# EAGLE design bravo-v3 (EAGLE 9.1.3)

## Sheet 1 of 2
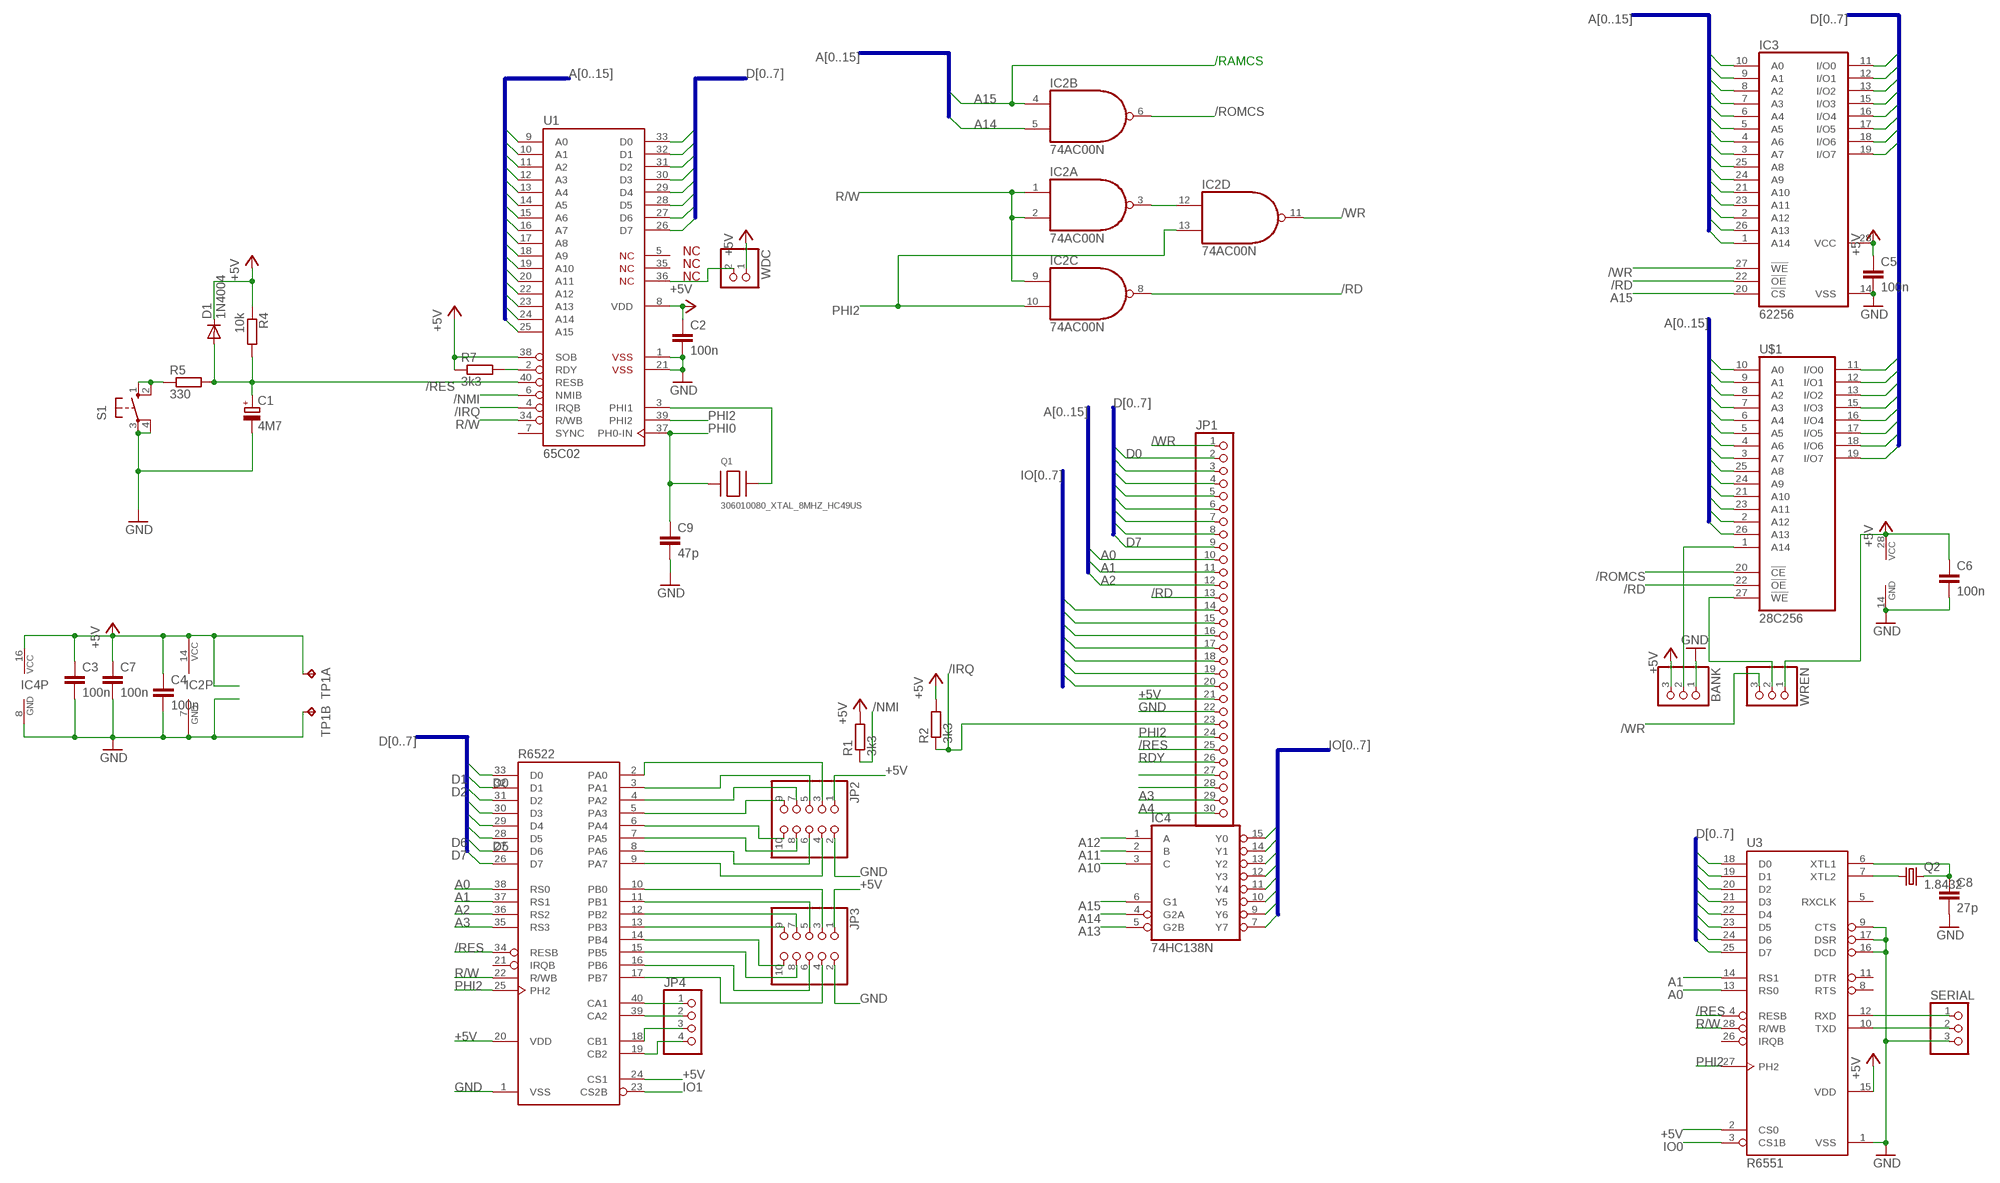
[diagram p0: schematic, sheet 1]

### Parts
BANK  PINHD-1X3  [1X03]
C1  4M7  CPOL-EUE2.5-6  [E2,5-6]
C2  100n  C-EU025-030X050  [C025-030X050]
C3  100n  C-EU025-030X050  [C025-030X050]
C4  100n  C-EU025-030X050  [C025-030X050]
C5  100n  C-EU025-030X050  [C025-030X050]
C6  100n  C-EU025-030X050  [C025-030X050]
C7  100n  C-EU025-030X050  [C025-030X050]
C8  27p  C-EU050-030X075  [C050-030X075]
C9  47p  C-EU025-030X050  [C025-030X050]
D1  1N4004  [DO41-10]
IC2  74AC00N  74ALS00N  [DIL14]
IC3  62256  62256P  [DIL28-6]
IC4  74HC138N  [DIL16]
JP1  PINHD-1X30  [1X30]
JP2  PINHD-2X5  [2X05]
JP3  PINHD-2X5  [2X05]
JP4  PINHD-1X4  [1X04]
Q1  306010080_XTAL_8MHZ_HC49US  [HC49US]
Q2  1.8432  CRYSTALHC49S  [HC49/S]
R1  3k3  R-EU_0207/7  [0207/7]
R2  3k3  R-EU_0207/7  [0207/7]
R4  10k  R-EU_0207/7  [0207/7]
R5  330  R-EU_0207/7  [0207/7]
R7  3k3  R-EU_0207/7  [0207/7]
R6522  G65SC22P  [DIP-40]
S1  40-XX  [B3F-40XX]
SERIAL  PINHD-1X3  [1X03]
TP1  TP2P2-38-17  [P2-38-17]
U1  65C02  G65SC02P  [DIP-40]
U3  R6551  G65SC51P  [DIP-28]
U$1  28C256  [DIL28]
WDC  PINHD-1X2  [1X02]
WREN  PINHD-1X3  [1X03]

### Nets
+5V [supply]: BANK.3 C2.1 C3.1 C4.1 C5.1 C6.1 C7.1 D1.C IC2.14(P:VCC) IC3.28(VCC) IC4.16(VCC) JP1.21 JP2.1 JP3.1 R1.2 R2.2 R4.1 R7.1 R6522.20(VDD) R6522.24(CS1) TP1.TP-1 U1.8(VDD) U1.38(SOB) U3.2(CS0) U3.15(VDD) U$1.28(VCC) WDC.1 WREN.1
/IRQ: JP1.23 R2.1 U1.4(IRQB)
/NMI: R1.1 U1.6(NMIB)
/RD: IC2.8(C:O) IC3.22(!OE) JP1.13 U$1.22(!OE)
/RES: C1.+ D1.A JP1.25 R4.2 R5.2 R6522.34(RESB) U1.40(RESB) U3.4(RESB)
/ROMCS: IC2.6(B:O) U$1.20(!CE)
/WR: IC2.11(D:O) IC3.27(!WE) JP1.1 WREN.3
A0: IC3.10(A0) JP1.10 R6522.38(RS0) U1.9(A0) U3.13(RS0) U$1.10(A0)
A1: IC3.9(A1) JP1.11 R6522.37(RS1) U1.10(A1) U3.14(RS1) U$1.9(A1)
A2: IC3.8(A2) JP1.12 R6522.36(RS2) U1.11(A2) U$1.8(A2)
A3: IC3.7(A3) JP1.29 R6522.35(RS3) U1.12(A3) U$1.7(A3)
A4: IC3.6(A4) JP1.30 U1.13(A4) U$1.6(A4)
A5: IC3.5(A5) U1.14(A5) U$1.5(A5)
A6: IC3.4(A6) U1.15(A6) U$1.4(A6)
A7: IC3.3(A7) U1.16(A7) U$1.3(A7)
A8: IC3.25(A8) U1.17(A8) U$1.25(A8)
A9: IC3.24(A9) U1.18(A9) U$1.24(A9)
A10: IC3.21(A10) IC4.3(C) U1.19(A10) U$1.21(A10)
A11: IC3.23(A11) IC4.2(B) U1.20(A11) U$1.23(A11)
A12: IC3.2(A12) IC4.1(A) U1.22(A12) U$1.2(A12)
A13: IC3.26(A13) IC4.5(G2B) U1.23(A13) U$1.26(A13)
A14: IC2.5(B:I1) IC3.1(A14) IC4.4(G2A) U1.24(A14)
A15: IC2.4(B:I0) IC3.20(!CS) IC4.6(G1) U1.25(A15)
CA1: JP4.1 R6522.40(CA1)
D0: IC3.11(I/O0) JP1.2 R6522.33(D0) U1.33(D0) U3.18(D0) U$1.11(I/O0)
D1: IC3.12(I/O1) JP1.3 R6522.32(D1) U1.32(D1) U3.19(D1) U$1.12(I/O1)
D2: IC3.13(I/O2) JP1.4 R6522.31(D2) U1.31(D2) U3.20(D2) U$1.13(I/O2)
D3: IC3.15(I/O3) JP1.5 R6522.30(D3) U1.30(D3) U3.21(D3) U$1.15(I/O3)
D4: IC3.16(I/O4) JP1.6 R6522.29(D4) U1.29(D4) U3.22(D4) U$1.16(I/O4)
D5: IC3.17(I/O5) JP1.7 R6522.28(D5) U1.28(D5) U3.23(D5) U$1.17(I/O5)
D6: IC3.18(I/O6) JP1.8 R6522.27(D6) U1.27(D6) U3.24(D6) U$1.18(I/O6)
D7: IC3.19(I/O7) JP1.9 R6522.26(D7) U1.26(D7) U3.25(D7) U$1.19(I/O7)
GND [supply]: BANK.1 C1.- C2.2 C3.2 C4.2 C5.2 C6.2 C7.2 C8.2 C9.2 IC2.7(P:GND) IC3.14(VSS) IC4.8(GND) JP1.22 JP2.2 JP3.2 R6522.1(VSS) S1.3(P) S1.4(P1) SERIAL.3 TP1.TP-2 U1.1(VSS$1) U1.21(VSS$2) U3.1(VSS) U3.9(CTS) U3.16(DCD) U3.17(DSR) U$1.14(GND)
IO0: IC4.15(Y0) U3.3(CS1B)
IO1: IC4.14(Y1) JP1.14 R6522.23(CS2B)
IO2: IC4.13(Y2) JP1.15
IO3: IC4.12(Y3) JP1.16
IO4: IC4.11(Y4) JP1.17
IO5: IC4.10(Y5) JP1.18
IO6: IC4.9(Y6) JP1.19
IO7: IC4.7(Y7) JP1.20
N$1: R5.1 S1.1(S) S1.2(S1)
N$2: JP2.9 R6522.5(PA3)
N$3: JP2.7 R6522.4(PA2)
N$4: JP1.27
N$5: JP1.28
N$6: JP2.5 R6522.3(PA1)
N$7: JP2.3 R6522.2(PA0)
N$8: U1.36(NC$3) WDC.2
N$9: BANK.2 U$1.1(A14)
N$10: IC2.3(A:O) IC2.12(D:I0)
N$11: JP2.10 R6522.6(PA4)
N$12: JP2.8 R6522.7(PA5)
N$13: JP2.6 R6522.8(PA6)
N$14: JP2.4 R6522.9(PA7)
N$15: JP3.3 R6522.10(PB0)
N$16: JP3.5 R6522.11(PB1)
N$17: JP3.7 R6522.12(PB2)
N$18: JP3.9 R6522.13(PB3)
N$19: JP3.10 R6522.14(PB4)
N$20: JP3.8 R6522.15(PB5)
N$21: JP3.6 R6522.16(PB6)
N$22: JP3.4 R6522.17(PB7)
N$24: JP4.2 R6522.39(CA2)
N$25: JP4.3 R6522.18(CB1)
N$26: JP4.4 R6522.19(CB2)
N$31: U$1.27(!WE) WREN.2
N$33: Q1.P$2 U1.3(PHI1)
N$35: SERIAL.1 U3.12(RXD)
N$36: SERIAL.2 U3.10(TXD)
N$38: Q2.1 U3.7(XTL2)
N$39: C8.1 Q2.2 U3.6(XTL1)
PHI0: C9.1 Q1.P$1 U1.37(PH0-IN)
PHI2: IC2.10(C:I1) IC2.13(D:I1) JP1.24 R6522.25(PH2) U1.39(PHI2) U3.27(PH2)
R/W: IC2.1(A:I0) IC2.2(A:I1) IC2.9(C:I0) R6522.22(R/WB) U1.34(R/WB) U3.28(R/WB)
RDY: JP1.26 R7.2 U1.2(RDY)
Unconnected: R6522.21(IRQB) U1.5(NC$1) U1.7(SYNC) U1.35(NC$2) U3.5(RXCLK) U3.8(RTS) U3.11(DTR) U3.26(IRQB)

### Buses
A[0..15]
D[0..7]
IO[0..7]

### Notes on the sheet
- /RAMCS

## Sheet 2 of 2

## Library data of the parts
BANK SERIAL WREN = pinhead:PINHD-1X3: PIN HEADER
C1 = rcl:CPOL-EU: POLARIZED CAPACITOR, European symbol
C2-C9 = rcl:C-EU: CAPACITOR, European symbol
D1 = adafruit:1N4004: DIODE General purpose 1N400x type rectifier (With bigger pads) http://www.ladyada.net/library/pcb/eaglelibrary.html
IC2 = 74xx-us:74*00: Quad 2-input NAND gate
IC3 = memory-hitachi:62256P: MEMORY; OC_FARNELL: unknown; OC_NEWARK: unknown
IC4 = 74xx-eu:74*138: 3-line to 8-line DECODER/DEMULTIPLEXER
JP1 = pinhead:PINHD-1X30: PIN HEADER
JP2 JP3 = pinhead:PINHD-2X5: PIN HEADER
JP4 = pinhead:PINHD-1X4: PIN HEADER
Q1 = Seeed-OPL-2017-01-Crystal-Akita:306010080_XTAL_8MHZ_HC49US: HC49/US-11.35X4.65X3.6, DIP Crystal 8MHz-20pF-30ppm-80R, SKU: 306010080
Q2 = adafruit:CRYSTAL: CRYSTAL; OC_FARNELL: 1667008; OC_NEWARK: unknown
R1 R2 R4 R5 R7 = rcl:R-EU_: RESISTOR, European symbol
R6522 = 65xxx:G65SC22P: California Micro Devices Version
S1 = adafruit:40-XX: OMRON SWITCH; MF: OMRON COMPONENTS USA; MPN: B3F-4000; OC_FARNELL: 176434; OC_NEWARK: 36K3105
TP1 = testpad:TP2: Test pad
U1 = 65xxx:G65SC02P: California Micro Devices Version
U3 = 65xxx:G65SC51P: California Micro Devices Version
U$1 = memory:28C256: MEMORY
WDC = pinhead:PINHD-1X2: PIN HEADER

## Net classes
1 supply: width 0.61 mm

## Board
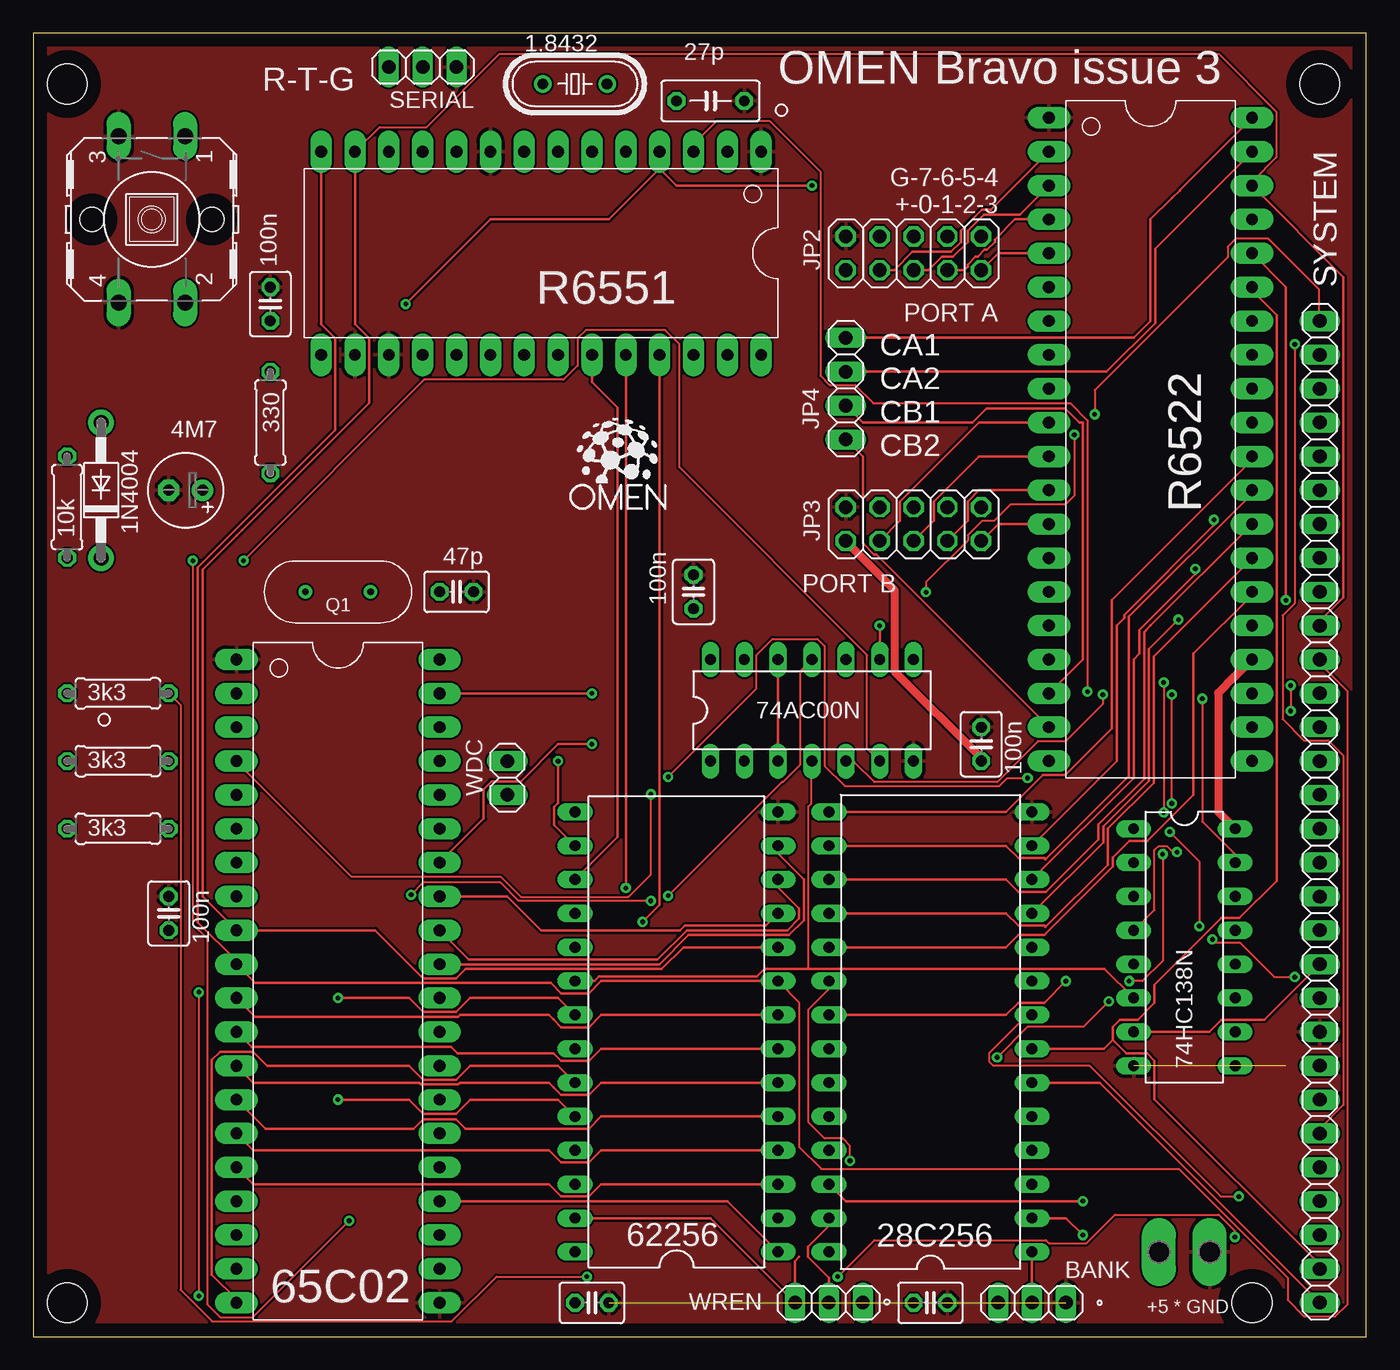
[diagram p1: board, top side]
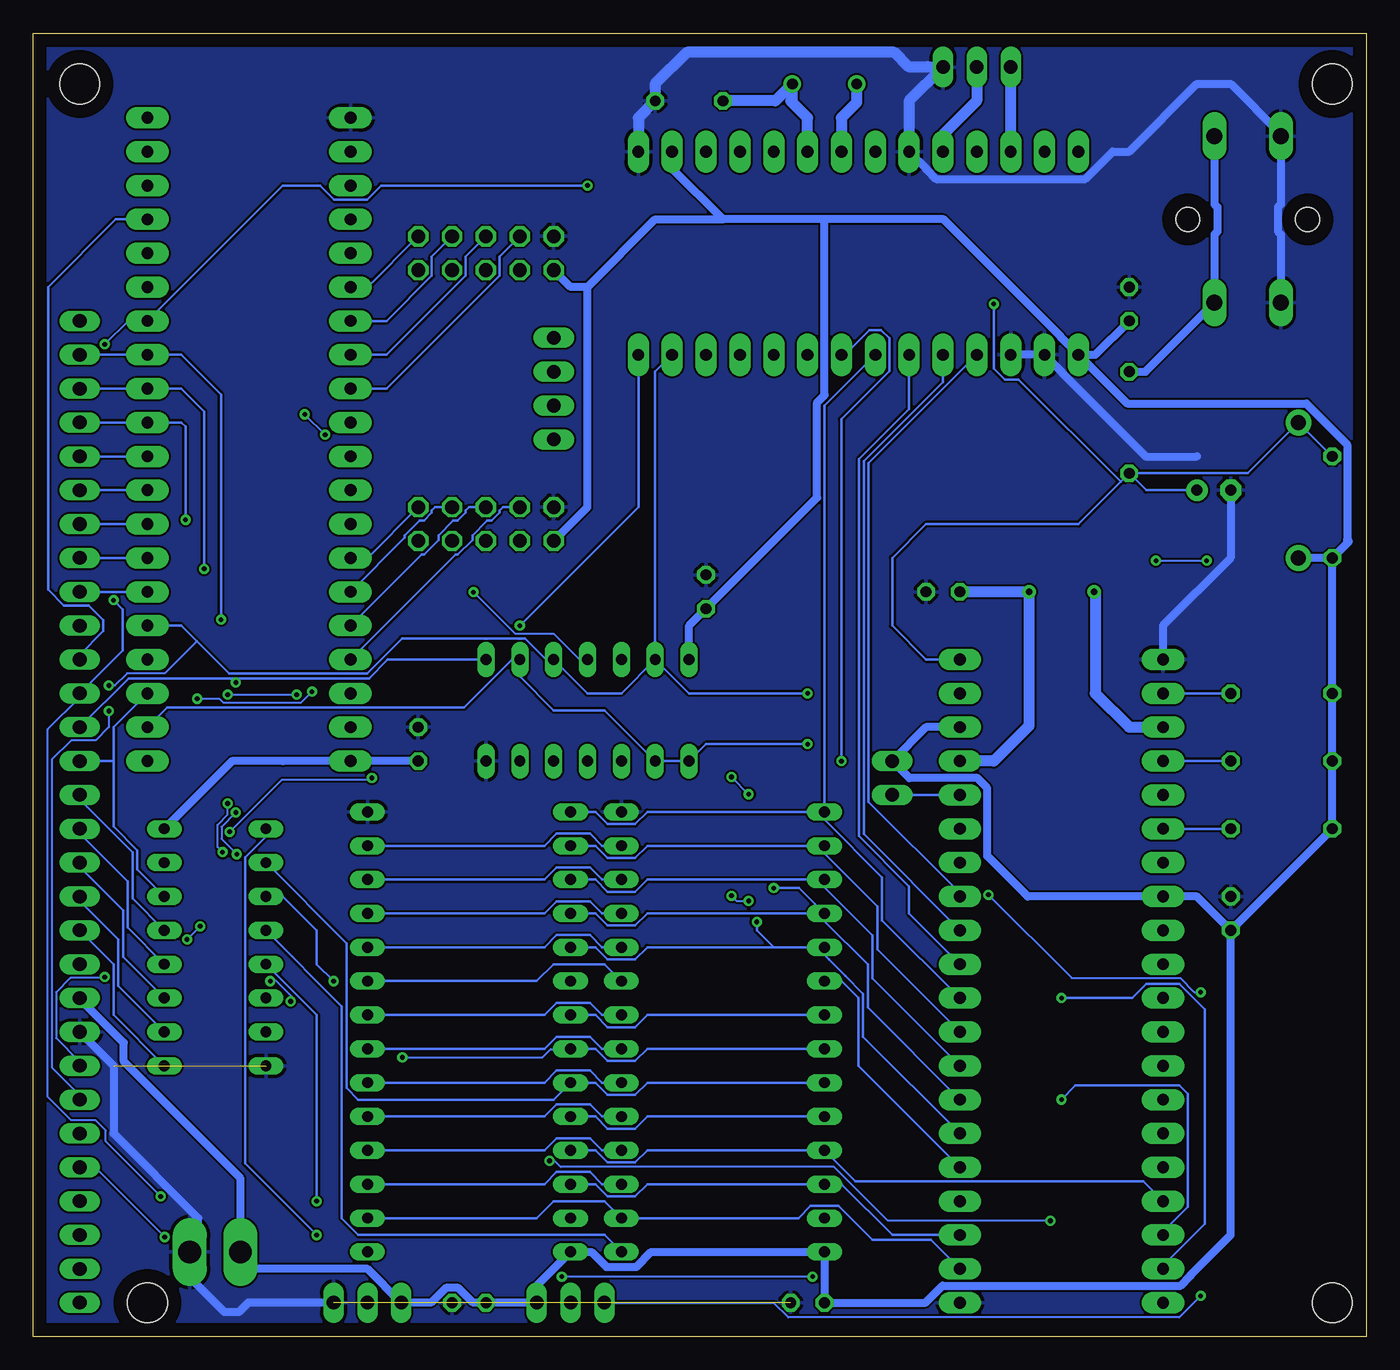
[diagram p2: board, bottom side, seen from below]

Size 100 x 97.78 mm. Coordinates in mm from the lower left corner, seen from the top.
Outline: 0,0 100,0 100,97.78 0,97.78 0,0
Copper layers (1*16): Top 0.035mm / dielectric 1.5mm / Bottom 0.035mm
Design rules "default": minimum track width 6mil, minimum drill 0.35mm, track to track 6mil, track to pad 6mil, pad to pad 6mil, via to via 6mil, smd to smd 6mil, copper to edge 40mil, drill to drill 6mil, minimum pad ring 10mil, minimum via ring 8mil, stop-mask expansion 4mil, vias tented up to drill 0mil, thermal gap 10mil
Holes 3 mm at 2.54,2.54 2.54,93.98 91.44,2.54 96.52,93.98

### Footprints (pad centres in the part's own frame; a part is rotated, then mirrored left to right if it is on the bottom)
1X03 = drill 1.016 long: 1 -2.54,0; 2 0,0; 3 2.54,0
E2,5-6 = drill 0.813 pad 1.6: + -1.27,0 | drill 0.813 pad 1.6 octagon: - 1.27,0
C025-030X050 = drill 0.813 octagon: 1 -1.27,0; 2 1.27,0
C050-030X075 = drill 0.813 octagon: 1 -2.54,0; 2 2.54,0
DO41-10 = drill 1.118 pad 1.93: A 5.08,0; C -5.08,0
DIL14 = drill 0.813 long: 1 -7.62,-3.81; 2 -5.08,-3.81; 3 -2.54,-3.81; 4 0,-3.81; 5 2.54,-3.81; 6 5.08,-3.81; 7 7.62,-3.81; 8 7.62,3.81; 9 5.08,3.81; 10 2.54,3.81; 11 0,3.81; 12 -2.54,3.81; 13 -5.08,3.81; 14 -7.62,3.81
DIL28-6 = drill 0.813 long: 1 -16.51,-7.62; 2 -13.97,-7.62; 3 -11.43,-7.62; 4 -8.89,-7.62; 5 -6.35,-7.62; 6 -3.81,-7.62; 7 -1.27,-7.62; 8 1.27,-7.62; 9 3.81,-7.62; 10 6.35,-7.62; 11 8.89,-7.62; 12 11.43,-7.62; 13 13.97,-7.62; 14 16.51,-7.62; 15 16.51,7.62; 16 13.97,7.62; 17 11.43,7.62; 18 8.89,7.62; 19 6.35,7.62; 20 3.81,7.62; 21 1.27,7.62; 22 -1.27,7.62; 23 -3.81,7.62; 24 -6.35,7.62; 25 -8.89,7.62; 26 -11.43,7.62; 27 -13.97,7.62; 28 -16.51,7.62
DIL16 = drill 0.813 long: 1 -8.89,-3.81; 2 -6.35,-3.81; 3 -3.81,-3.81; 4 -1.27,-3.81; 5 1.27,-3.81; 6 3.81,-3.81; 7 6.35,-3.81; 8 8.89,-3.81; 9 8.89,3.81; 10 6.35,3.81; 11 3.81,3.81; 12 1.27,3.81; 13 -1.27,3.81; 14 -3.81,3.81; 15 -6.35,3.81; 16 -8.89,3.81
1X30 = drill 1.016 long: 1 -36.83,0; 2 -34.29,0; 3 -31.75,0; 4 -29.21,0; 5 -26.67,0; 6 -24.13,0; 7 -21.59,0; 8 -19.05,0; 9 -16.51,0; 10 -13.97,0; 11 -11.43,0; 12 -8.89,0; 13 -6.35,0; 14 -3.81,0; 15 -1.27,0; 16 1.27,0; 17 3.81,0; 18 6.35,0; 19 8.89,0; 20 11.43,0; 21 13.97,0; 22 16.51,0; 23 19.05,0; 24 21.59,0; 25 24.13,0; 26 26.67,0; 27 29.21,0; 28 31.75,0; 29 34.29,0; 30 36.83,0
2X05 = drill 1.016 octagon: 1 -5.08,-1.27; 2 -5.08,1.27; 3 -2.54,-1.27; 4 -2.54,1.27; 5 0,-1.27; 6 0,1.27; 7 2.54,-1.27; 8 2.54,1.27; 9 5.08,-1.27; 10 5.08,1.27
1X04 = drill 1.016 long: 1 -3.81,0; 2 -1.27,0; 3 1.27,0; 4 3.81,0
HC49US = drill 0.5: P$1 -2.44,0; P$2 2.44,0
HC49/S = drill 0.813: 1 -2.413,0; 2 2.413,0
0207/7 = drill 0.813 octagon: 1 -3.81,0; 2 3.81,0
DIP-40 = drill 0.889 pad 1.6 long: 1 -22.86,-7.62; 2 -20.32,-7.62; 3 -17.78,-7.62; 4 -15.24,-7.62; 5 -12.7,-7.62; 6 -10.16,-7.62; 7 -7.62,-7.62; 8 -5.08,-7.62; 9 -2.54,-7.62; 10 0,-7.62; 11 2.54,-7.62; 12 5.08,-7.62; 13 7.62,-7.62; 14 10.16,-7.62; 15 12.7,-7.62; 16 15.24,-7.62; 17 17.78,-7.62; 18 20.32,-7.62; 19 22.86,-7.62; 20 25.4,-7.62; 21 25.4,7.62; 22 22.86,7.62; 23 20.32,7.62; 24 17.78,7.62; 25 15.24,7.62; 26 12.7,7.62; 27 10.16,7.62; 28 7.62,7.62; 29 5.08,7.62; 30 2.54,7.62; 31 0,7.62; 32 -2.54,7.62; 33 -5.08,7.62; 34 -7.62,7.62; 35 -10.16,7.62; 36 -12.7,7.62; 37 -15.24,7.62; 38 -17.78,7.62; 39 -20.32,7.62; 40 -22.86,7.62
B3F-40XX = drill 1.194 long: 1 -6.248,2.489; 2 6.248,2.489; 3 -6.248,-2.489; 4 6.248,-2.489 | hole 1.803: 0,-4.496; 0,4.496
P2-38-17 = drill 1.702 pad 2.121 long: TP-1 -1.905,0; TP-2 1.905,0
DIP-28 = drill 0.889 pad 1.6 long: 1 -15.24,-7.62; 2 -12.7,-7.62; 3 -10.16,-7.62; 4 -7.62,-7.62; 5 -5.08,-7.62; 6 -2.54,-7.62; 7 0,-7.62; 8 2.54,-7.62; 9 5.08,-7.62; 10 7.62,-7.62; 11 10.16,-7.62; 12 12.7,-7.62; 13 15.24,-7.62; 14 17.78,-7.62; 15 17.78,7.62; 16 15.24,7.62; 17 12.7,7.62; 18 10.16,7.62; 19 7.62,7.62; 20 5.08,7.62; 21 2.54,7.62; 22 0,7.62; 23 -2.54,7.62; 24 -5.08,7.62; 25 -7.62,7.62; 26 -10.16,7.62; 27 -12.7,7.62; 28 -15.24,7.62
DIL28 = drill 0.813 long: 1 -16.51,-7.62; 2 -13.97,-7.62; 3 -11.43,-7.62; 4 -8.89,-7.62; 5 -6.35,-7.62; 6 -3.81,-7.62; 7 -1.27,-7.62; 8 1.27,-7.62; 9 3.81,-7.62; 10 6.35,-7.62; 11 8.89,-7.62; 12 11.43,-7.62; 13 13.97,-7.62; 14 16.51,-7.62; 15 16.51,7.62; 16 13.97,7.62; 17 11.43,7.62; 18 8.89,7.62; 19 6.35,7.62; 20 3.81,7.62; 21 1.27,7.62; 22 -1.27,7.62; 23 -3.81,7.62; 24 -6.35,7.62; 25 -8.89,7.62; 26 -11.43,7.62; 27 -13.97,7.62; 28 -16.51,7.62
1X02 = drill 1.016 long: 1 -1.27,0; 2 1.27,0

### Placement (x,y rotation side)
BANK  74.93,2.54 180 top
C1  11.43,63.5 180 top
C2  49.53,55.88 90 top
C3  17.78,77.47 90 top
C4  10.16,31.75 90 top
C5  67.31,2.54 0 top
C6  41.91,2.54 0 top
C7  71.12,44.45 90 top
C8  50.8,92.71 0 top
C9  31.75,55.88 0 top
D1  5.08,63.5 90 top
IC2  58.42,46.99 0 top
IC3  48.26,22.86 90 top
IC4  86.36,29.21 270 top
JP1  96.52,39.37 270 top
JP2  66.04,81.28 0 top
JP3  66.04,60.96 0 top
JP4  60.96,71.12 270 top
Q1  22.86,55.88 180 top
Q2  40.64,93.98 0 top
R1  6.35,38.1 180 top
R2  6.35,43.18 180 top
R4  2.54,62.23 90 top
R5  17.78,68.58 270 top
R7  6.35,48.26 0 top
R6522  83.82,68.58 270 top
S1  8.89,83.82 270 top
SERIAL  29.21,95.25 0 top
TP1  86.36,6.35 0 top
U1  22.86,27.94 270 top
U3  39.37,81.28 180 top
U$1  67.31,22.86 90 top
WDC  35.56,41.91 270 top
WREN  59.69,2.54 180 top

### Tracks (layer width: path | path; a pad name or v marks a point on that pad's centre or on a via)
+5V
  Top 0.61: R6522.24 90.16,49.52 90.12,49.52 88.9,48.3 88.9,39.37 IC4.16 | C7.1 71.09,43.2 71.09,43.43 64.62,49.91 64.62,56.01 60.96,59.66 JP3.1
  Bottom 0.61: C7.1 R6522.20 81.28,43.18 85.09,43.18 IC4.16 | C4.1 10.16,7.62 13.18,4.6 13.18,4.56 13.92,3.82 31.77,3.82 33.06,2.54 C6.1 IC3.28 53.64,6.35 54.76,5.23 57,5.23 58.12,6.35 U$1.28 62.23,3.81 WREN.1 C5.1 67,2.54 68.12,3.66 69.04,3.66 70.16,2.54 BANK.3 74.93,5.08 83.82,5.08 84.45,5.71 TP1.TP-1 84.45,11.87 93.22,20.64 93.22,22.04 96.52,25.35 JP1.21 | C4.1 R1.2 R2.2 R7.1 R4.1 | R4.1 D1.C | U1.38 33.02,45.72 WDC.1 34.28,41.9 29.16,41.9 28.42,41.16 28.42,36.04 25.4,33.02 U1.8 12.7,33.02 C4.1 | U3.15 17.93,70 4.49,70 1.42,66.93 1.42,59.79 1.32,59.69 1.32,59.64 R4.1 | U3.15 22.87,74.94 22.87,74.98 31.71,83.82 40.64,83.82 | 40.64,83.82 48.26,83.82 | U3.2 52.07,87.63 48.26,83.82 | U3.15 20.32,73.66 C3.1 | IC2.14 50.8,53.34 C2.1 41.2,62.94 41.2,70.08 40.64,70.64 40.64,83.82 | JP3.1 58.42,62.23 58.42,78.74 | 58.42,78.74 59.69,78.74 JP2.1 | 58.42,78.74 53.34,83.82 48.26,83.82
/IRQ  (via drill 0.35)
  Top 0.152: v94.64,26.98 93.12,26.98 90.53,29.57 88.7,29.57 v88.47,29.79 | v87.48,30.79 87.48,35.66 v85.27,37.87 | v74.6,41.91 73.08,41.91 72.47,41.3 60.88,41.3 59.36,42.82 59.36,51.82 58.83,52.35 55.47,52.35 54.25,51.13 54.25,48.62 v47.62,41.99 | v46.33,40.69 46.33,34.67 44.65,32.99 36.58,32.99 35.05,34.52 23.85,34.52 15.24,43.13 U1.4
  Bottom 0.152: v94.64,26.98 94.72,26.9 97.23,26.9 98.3,25.83 98.3,22.4 96.55,20.65 96.55,20.34 JP1.23 | v87.48,30.79 v88.47,29.79 | v85.27,37.87 81.38,41.76 74.75,41.76 v74.6,41.91 | v46.33,40.69 v47.62,41.99
  Bottom 0.203: R2.1 U1.4
/NMI
  Bottom 0.203: R1.1 U1.6
/RD  (via drill 0.35)
  Top 0.152: v72.31,20.95 74.6,23.24 78.79,23.24 v80.7,25.15 | v82.22,26.67 83.21,26.67 84.73,28.19 v84.73,36.2 | v84.81,49.07 v84.81,39.32
  Bottom 0.152: v72.31,20.95 61.8,20.95 61.19,21.57 59.74,21.57 U$1.22 | v80.7,25.15 80.47,25.38 81.84,26.75 82.14,26.75 v82.22,26.67 | v84.73,36.2 85.88,37.34 85.88,38.25 v84.81,39.32 | v84.81,49.07 84.81,49.3 84.81,49.39
  Bottom 0.203: U$1.22 57.83,21.59 56.92,20.68 54.84,20.68 53.93,21.59 IC3.22 | IC2.8 73.41,50.8 74.82,49.39 84.81,49.39 92.85,49.39 JP1.13
/RES  (via drill 0.35)
  Top 0.152: v94.64,74.45 94.64,55.02 93.73,54.1 93.73,46.33 95.33,44.73 97.16,44.73 98.3,43.59 98.3,17.37 96.55,15.62 96.55,15.24 JP1.25
  Top 0.203: v27.94,77.47 34.29,83.82 43.18,83.82 46.99,87.63 | 46.99,87.63 U3.4 | v58.42,86.36 48.26,86.36 46.99,87.63
  Bottom 0.152: v94.64,74.45 92.89,76.2 91.52,76.2 R6522.34
  Bottom 0.203: R4.2 D1.A 8.89,64.77 R5.2 | C1.+ 16.51,63.5 R5.2 | R5.2 18.41,64.14 | 18.41,64.14 21.59,60.96 33.02,60.96 35.56,58.42 35.56,53.34 33.02,50.8 U1.40 | v27.94,77.47 27.94,72.64 27.11,71.81 26.09,71.81 18.41,64.14 | R6522.34 81.28,86.36 78.49,86.36 77.44,85.31 74.96,85.31 73.91,86.36 v58.42,86.36
/ROMCS  (via drill 0.35)
  Top 0.152: v61.27,13.18 61.27,14.33 60.73,14.86 59.36,14.86 58.14,16.08 58.14,24.54 59.66,26.06 59.66,26.67 U$1.20 | v23.7,8.69 16.46,1.45 14.02,1.45 13.03,2.44 13.03,29.87 11.96,30.94 v11.96,58.22 | v15.77,58.22 29.34,71.78 39.78,71.78 40.84,72.85 40.84,74.91 41.45,75.51 47.4,75.51 48.46,74.45 48.46,65.23 62.56,51.13 62.56,44.12 63.48,43.2 IC2.6
  Bottom 0.152: v61.27,13.18 60.88,13.18 60.43,12.72 39.93,12.72 35.89,8.69 v23.7,8.69 | v15.77,58.22 v11.96,58.22
/WR  (via drill 0.35)
  Top 0.152: v66.98,55.85 66.98,56.62 70.1,59.74 70.1,60.12 71.17,61.19 72.08,61.19 73.3,62.41 77.42,62.41 78.11,63.09 v78.11,67.67 | v79.63,69.19 79.63,71.02 89.61,81 89.61,81.76 90.22,82.37 92.66,82.37 96.47,78.56 96.47,76.2 JP1.1 | v12.42,25.83 v12.42,3.05 | v28.35,33.15 29.26,34.06 35.05,34.06 36.42,32.69 v46.33,32.69 | v47.62,33.07 56.16,41.6 56.24,41.6 57.53,42.9 57.53,49.91 58.37,50.75 IC2.11
  Top 0.203: IC3.27 50.8,8.89 WREN.3 57.15,5.67 57.45,5.97
  Bottom 0.152: v66.98,55.85 63.86,52.73 60.96,52.73 59.05,50.83 58.45,50.83 IC2.11 | v79.63,69.19 v78.11,67.67 | v12.42,3.05 14.02,1.45 43.36,1.45 44.42,2.52 57.15,2.52 WREN.3 | v12.42,25.83 12.88,25.83 13.95,26.9 22.1,26.9 v28.35,33.15 | v46.33,32.69 47.24,32.69 v47.62,33.07
A0
  Top 0.152: R6522.38 91.52,86.41 91.52,86.72 93.27,88.47 93.27,91.9 88.92,96.24 34.98,96.24 29.49,90.75 25.98,90.75 24.16,88.92 U3.13
  Top 0.203: IC3.10 48.76,29.21 47.14,27.58 32.41,27.58 31.72,26.89 29.24,26.89 25.65,30.48 U1.9 12.7,33.02 12.7,57.56 15.67,60.53 | U3.13 24.13,75.95 25.18,74.9 25.18,70.04 15.67,60.53 | 15.67,60.53 15.24,60.1 | JP1.10 96.52,53.68 98.3,55.46 98.3,79.5 R6522.38
  Bottom 0.203: IC3.10 57.33,29.21 58.24,30.12 60.73,30.12 61.64,29.21 U$1.10
A1
  Top 0.152: JP1.11 96.55,50.75 96.55,50.44 98.6,48.39 98.6,2.44 97.69,1.52 95.33,1.52 94.11,2.74 94.11,4.42 85.95,12.57 59.13,12.57 57.45,14.25 57.45,25.07 55.93,26.59 IC3.9
  Top 0.203: IC3.9 42.59,26.67 41.68,25.76 39.6,25.76 38.83,26.53 16.65,26.53 U1.10 15.24,28.19 12.34,31.09 12.34,57.7 22.64,68 22.64,74.9 21.59,75.95 U3.14
  Bottom 0.203: U$1.9 62.23,26.67 60.96,27.94 57.15,27.94 IC3.9 | JP1.11 96.52,51.14 94.74,52.92 94.74,53.76 95.84,54.86 97.7,54.86 98.88,56.04 98.88,78.74 93.8,83.82 R6522.37
A2  (via drill 0.35)
  Top 0.152: v90.45,10.52 89.08,10.52 79.25,20.34 72.01,20.34 71.7,20.65 71.7,21.26 74.52,24.08 74.91,24.08 U$1.8
  Top 0.203: IC3.8 42.59,24.13 41.68,23.22 39.6,23.22 39.03,23.79 | 39.03,23.79 38.69,24.13 | 39.03,23.79 38.69,24.13 | 38.69,24.13 32,24.13 31.86,23.99 16.65,23.99 U1.11 | v93.98,55.25 93.98,78.74 R6522.36
  Bottom 0.152: v90.45,10.52 94.56,14.63 94.56,15.47 95.33,16.23 97.16,16.23 98.91,17.98 98.91,45.57 96.55,47.93 96.55,48.23 JP1.12
  Bottom 0.203: IC3.8 57.33,24.13 58.24,25.04 60.73,25.04 61.64,24.13 U$1.8 | JP1.12 93.29,51.49 93.29,53.34 | 93.29,53.34 93.29,53.78 | 93.29,53.34 93.29,54.56 v93.98,55.25
A3
  Top 0.203: IC3.7 42.59,21.59 41.68,20.68 39.6,20.68 39.03,21.25 31.84,21.25 31.36,21.73 16.37,21.73 U1.12 | R6522.35 91.44,78.49 93.29,76.64 93.29,34.19 90.5,31.39 89.13,31.39 84.12,26.39 84.12,25.02 82.88,23.77 81.51,23.77 80.97,23.24 80.97,22.25 | U$1.7 80.31,21.59 80.97,22.25 | 80.97,22.25 81.99,21.23 83.59,21.23 84.12,20.7 84.12,17.82 96.52,5.42 JP1.29
  Bottom 0.203: IC3.7 57.33,21.59 58.24,22.5 60.73,22.5 61.64,21.59 U$1.7
A4
  Top 0.203: U1.13 16.51,19.05 28.96,19.05 29.1,18.91 31.86,18.91 32,19.05 38.69,19.05 | IC3.6 42.59,19.05 41.68,18.14 39.6,18.14 39.03,18.71 | 39.03,18.71 38.69,19.05 | 38.69,19.05 39.03,18.71 | JP1.30 80.01,19.05 U$1.6
  Bottom 0.203: IC3.6 57.33,19.05 58.24,19.96 60.73,19.96 61.64,19.05 U$1.6
A5
  Top 0.203: 16.51,16.51 U1.14 17.42,15.6 28.55,15.6 29.24,16.29 31.72,16.29 32.41,15.6 40.64,15.6 | 40.64,15.6 41.68,15.6 42.59,16.51 IC3.5 | 40.64,15.6 39.6,15.6
  Bottom 0.203: IC3.5 57.33,16.51 58.24,17.42 60.73,17.42 61.64,16.51 U$1.5
A6
  Top 0.203: U1.15 16.51,13.97 38.69,13.97 39.6,13.06 41.68,13.06 42.59,13.97 IC3.4
  Bottom 0.203: IC3.4 57.33,13.97 58.24,14.88 60.73,14.88 61.64,13.97 U$1.4
A7
  Top 0.203: U1.16 16.51,11.43 38.69,11.43 39.6,10.52 41.68,10.52 42.59,11.43 IC3.3
  Bottom 0.203: IC3.3 57.33,11.43 58.24,12.34 60.73,12.34 61.64,11.43 U$1.3
A8
  Bottom 0.203: U$1.25 57.83,13.97 56.92,13.06 54.84,13.06 53.93,13.97 IC3.25 38.32,11.65 16.73,11.65 U1.17
A9  (via drill 0.35)
  Top 0.203: v22.86,17.78 28.19,17.78 29.24,16.73 31.72,16.73 32.77,17.78 39.37,17.78 IC3.24
  Bottom 0.203: U$1.24 57.83,16.51 56.92,15.6 54.84,15.6 53.93,16.51 IC3.24 | U1.18 15.24,7.87 13.39,9.72 13.39,18.22 14,18.83 21.81,18.83 v22.86,17.78
A10  (via drill 0.35)
  Top 0.203: IC3.21 39.37,25.4 32.77,25.4 31.72,24.35 29.24,24.35 28.19,25.4 v22.86,25.4 | v77.47,26.67 75.84,25.04 73.89,25.04 72.98,24.13 U$1.21
  Bottom 0.203: U$1.21 57.83,24.13 56.92,23.22 54.84,23.22 53.93,24.13 IC3.21 | U1.19 15.24,5.33 12.12,8.45 12.12,24.57 14,26.45 16.48,26.45 17.53,25.4 v22.86,25.4 | v77.47,26.67 78.74,27.94 78.74,30.48 81.28,33.02 IC4.3
A11
  Top 0.203: U1.20 15.24,2.79 13.39,4.64 13.39,20.76 14,21.37 16.48,21.37 17.53,20.32 28.19,20.32 29.24,19.27 31.72,19.27 32.77,20.32 39.37,20.32 IC3.23
  Bottom 0.203: IC3.23 53.93,19.05 54.84,18.14 56.92,18.14 57.83,19.05 U$1.23 60.96,17.78 75.61,17.78 76.5,18.67 76.5,29.52 IC4.2
A12  (via drill 0.35)
  Top 0.203: v78.74,7.62 77.47,8.89 U$1.2
  Bottom 0.203: U$1.2 62.23,8.89 60.96,10.16 57.15,10.16 IC3.2 42.59,8.89 41.68,9.8 39.6,9.8 37.06,7.26 32.66,7.26 U1.22 | IC4.1 82.55,37.51 84.12,35.94 84.12,13.01 v78.74,7.62
A13  (via drill 0.35)
  Top 0.203: v78.74,10.16 60.96,10.16 U$1.26
  Bottom 0.203: U$1.26 57.83,11.43 56.92,10.52 54.84,10.52 53.93,11.43 IC3.26 39.37,11.43 35.56,7.62 U1.23 | IC4.5 78.74,24.13 v78.74,10.16
A14  (via drill 0.35)
  Top 0.152: v80.24,48.16 80.24,47.47 77.42,44.65 75.36,44.65 72.31,41.6 63.09,41.6 61.57,43.13 60.96,43.13 IC2.5 | v85.42,40.01 v85.42,48.16 | v85.8,36.35 85.5,36.35 85.04,36.8 84.43,36.8 84.12,36.5 84.12,32 82.6,30.48 IC4.4
  Top 0.203: U1.24 52.07,10.16 IC3.1
  Bottom 0.152: v85.42,48.16 v80.24,48.16 | v85.42,40.01 85.42,39.17 86.18,38.41 86.18,36.73 v85.8,36.35
  Bottom 0.203: IC4.4 76.86,24.79 76.86,8.87 75.61,7.62 57.15,7.62 IC3.1
A15
  Top 0.152: IC2.4 58.37,43.13 58.37,40.01 58.14,39.78 58.14,27.66 58.14,27.58
  Top 0.203: IC3.20 42.09,26.67 42.45,27.03 54.28,27.03 54.84,27.58 55.88,27.58 58.14,27.58 60.96,27.58 80.37,27.58 IC4.6
  Bottom 0.203: U1.25 38.1,20.32 38.1,25.4 39.37,26.67 IC3.20
CA1
  Top 0.203: R6522.40 86,86 86,85.98 85.47,85.45 85.45,85.45 83.82,83.82 83.82,76.2 82.55,74.93 JP4.1
D0  (via drill 0.35)
  Top 0.203: IC3.11 54.97,30.84 48.88,30.84 48.52,30.48 38.1,30.48 35.56,33.02 U1.33 | U$1.11 80.26,37.08 80.26,38.27 83.69,41.7 83.69,51.57 v85.91,53.79
  Bottom 0.203: IC3.11 57.33,31.75 58.24,32.66 60.73,32.66 61.64,31.75 U$1.11 | JP1.2 R6522.33 88.9,73.66 85.91,70.67 v85.91,53.79 | U1.33 30.48,33.27 37.34,40.13 37.34,65.53 U3.18
D1  (via drill 0.35)
  Top 0.203: IC3.12 55.88,33.7 57.45,32.13 57.45,31.37 56.56,30.48 49.03,30.48 46.84,28.3 32.66,28.3 U1.32 | U$1.12 82.55,41.91 82.55,50.8 82.98,51.23 82.98,53.01 87.18,57.21 v87.18,57.6
  Bottom 0.203: IC3.12 57.33,34.29 58.24,35.2 60.73,35.2 61.64,34.29 U$1.12 | JP1.3 R6522.32 88.9,71.12 87.18,69.4 v87.18,57.6 | U3.19 31.75,71.62 37.69,65.68 37.69,37.69 U1.32
D2  (via drill 0.35)
  Top 0.203: U1.31 46.99,27.94 49.17,30.12 56.71,30.12 57.81,31.22 57.81,34.31 55.88,36.24 IC3.13 | U$1.13 81.28,43.18 81.28,53.34 81.84,53.9 81.84,54.15 88.58,60.89 v88.58,61.28
  Bottom 0.203: IC3.13 57.33,36.83 58.24,37.74 60.73,37.74 61.64,36.83 U$1.13 | JP1.4 R6522.31 88.9,68.58 88.58,68.26 v88.58,61.28 | U1.31 34.29,31.75 34.29,33.79 38.05,37.55 38.05,65.83 34.29,69.59 U3.20
D3
  Top 0.203: U$1.15 72.98,39.37 75.73,42.13 77.44,42.13 80.92,45.61 80.92,55.27 91.44,65.79 R6522.30
  Bottom 0.203: U$1.15 57.83,39.37 56.92,38.46 54.84,38.46 53.93,39.37 IC3.15 | IC3.15 40.64,38.78 36.32,34.47 36.32,31.24 U1.30 | R6522.30 JP1.5 | IC3.15 40.64,69.85 U3.21
D4  (via drill 0.35)
  Top 0.203: v39.37,43.18 39.37,40.05 39.06,39.75 39.06,38.41 IC3.16 | U$1.16 72.98,36.83 73.89,35.92 75.84,35.92 75.95,35.81 82.19,42.06 82.19,54.01 91.44,63.25 R6522.29
  Bottom 0.203: U$1.16 57.83,36.83 56.92,35.92 54.84,35.92 53.93,36.83 IC3.16 40.64,36.24 36.68,32.28 36.68,29.06 U1.29 | R6522.29 JP1.6 | U3.22 39.12,73.66 37.27,75.51 36.39,75.51 35.78,74.9 35.78,72.42 39.37,68.83 v39.37,43.18
D5
  Top 0.203: U3.23 41.91,71.62 43.84,69.69 43.84,37.49 IC3.17 | U$1.17 72.98,34.29 73.89,33.38 75.97,33.38 79.91,37.31 79.91,38.42 83.34,41.85 83.34,52.86 83.82,53.34 | 83.46,52.98 83.82,53.34 | 83.82,53.34 R6522.28
  Bottom 0.203: U$1.17 57.83,34.29 56.92,33.38 54.84,33.38 53.93,34.29 IC3.17 40.64,33.7 37.03,30.1 37.03,26.87 U1.28 | R6522.28 JP1.7
D6  (via drill 0.35)
  Top 0.203: U3.24 v44.45,33.65 | U$1.18 72.98,31.75 73.89,30.84 75.84,30.84 75.95,30.73 80.62,35.4 80.62,38.12 84.05,41.55 84.05,51.03 R6522.27
  Bottom 0.203: U$1.18 57.83,31.75 56.92,30.84 54.84,30.84 53.93,31.75 IC3.18 | IC3.18 40.64,31.16 37.39,27.91 37.39,24.69 U1.27 | R6522.27 JP1.8 | IC3.18 42.54,33.65 v44.45,33.65
D7  (via drill 0.35)
  Top 0.203: U3.25 46.99,32.38 v45.72,31.11 | U$1.19 72.98,29.21 73.89,30.12 75.84,30.12 80.97,35.26 80.97,35.94 82.22,37.19 83.59,37.19 87.05,40.64 87.05,51.24 91.44,55.63 R6522.26
  Bottom 0.203: U$1.19 57.83,29.21 56.92,28.3 54.84,28.3 53.93,29.21 IC3.19 | IC3.19 40.64,28.62 40.3,28.28 | 39.06,27.05 40.3,28.28 | U1.26 37.74,22.5 37.74,25.73 39.06,27.05 | 39.06,27.05 40.3,28.28 | R6522.26 JP1.9 | IC3.19 44.45,29.21 45.72,30.48 v45.72,31.11
GND  (3 unrouted)
  Bottom 0.61: BANK.1 83.87,2.54 84.58,1.83 85.65,1.83 88.9,5.08 88.27,5.71 TP1.TP-2 87.63,6.99 87.63,8.89 93.98,15.24 93.98,20.32 JP1.22 | C1.- 10.16,58.42 15.24,53.34 U1.1 | S1.4 6.4,82.68 6.62,82.9 6.62,84.74 6.4,84.96 S1.3 6.4,90.22 10.16,93.98 12.7,93.98 17.78,88.9 19.01,88.9 21.07,86.84 32.27,86.84 33.01,87.58 33.01,87.62 U3.9 | U3.17 U3.16 22.85,72.38 22.85,72.34 16.55,66.04 12.7,66.04 | 32.92,95.4 32.92,95.25
  Bottom 0.813: U3.1 54.61,91.44 C8.2 53.34,93.98 50.96,96.36 35.4,96.36 34.29,95.25 32.92,95.25 SERIAL.3 34.29,92.71 U3.9
  pour Bottom: 17.78,59.69 33.02,59.69 34.29,58.42 34.29,54.61 33.02,53.34 33.02,43.18 31.75,41.91 20.32,41.91 17.78,44.45 13.97,44.45 12.7,45.72 12.7,54.61
  pour Bottom: 55.88,86.36 55.88,96.52 54.61,97.79 53.34,97.79 26.67,97.79 25.4,96.52 25.4,87.63 27.94,85.09 54.61,85.09
  pour Bottom: 100.33,0 100.33,97.79 0,97.79 0,1.27 1.27,0
  pour Top: 17.78,59.69 33.02,59.69 34.29,58.42 34.29,53.34 33.02,52.07 33.02,43.18 31.75,41.91 20.32,41.91 17.78,44.45 13.97,44.45 12.7,45.72 12.7,54.61
  pour Top: 33.02,96.52 48.26,96.52 53.34,96.52 55.88,93.98 55.88,86.36 53.34,83.82 35.56,83.82 33.02,86.36 33.02,88.9
  pour Top: 0,0 100.33,0 100.33,97.79 1.27,97.79 0,97.79
IO0  (via drill 0.35)
  Top 0.152: v87.71,47.85 87.71,38.63 90.14,36.2 90.14,35.59 IC4.15 | v79.1,48.39 79.1,68.73 77.8,70.03 63.02,70.03 61.65,71.4 59.74,71.4 59.05,72.08 59.05,87.4 55.24,91.21 51.28,91.21 49.53,89.46 49.53,88.92 U3.3
  Bottom 0.152: v87.71,47.85 86.03,47.85 85.72,47.55 79.93,47.55 v79.1,48.39
IO1
  Bottom 0.203: R6522.23 93.98,45.72 93.98,43.18 | 93.98,43.18 93.98,38.26 92.2,36.48 92.2,35.05 IC4.14 | JP1.14 93.98,43.18
IO2
  Bottom 0.203: IC4.13 92.56,32.87 92.56,36.34 96.52,40.3 JP1.15
IO3
  Bottom 0.203: IC4.12 92.91,30.68 92.91,34.15 96.52,37.76 JP1.16
IO4
  Bottom 0.203: IC4.11 93.27,28.5 93.27,31.97 96.52,35.22 JP1.17
IO5
  Bottom 0.203: IC4.10 93.62,26.31 93.62,29.78 96.52,32.68 JP1.18
IO6
  Bottom 0.203: IC4.9 93.98,24.13 93.98,27.94 JP1.19
IO7
  Top 0.203: JP1.20 92.35,23.77 89.13,23.77 88.22,22.86 IC4.7
N$1
  Bottom 0.61: R5.1 16.56,72.39 12.72,76.22 | 12.72,76.22 S1.2 | S1.2 12.72,76.22 | S1.1 11.38,84.96 11.16,84.74 11.16,82.9 11.38,82.68 S1.2
N$2
  Top 0.203: JP2.9 72.39,81.28 R6522.5
N$3
  Top 0.203: R6522.4 73.66,83.82 72.14,82.3 72.14,82.13 71.54,81.53 71.37,81.53 70.87,81.03 70.7,81.03 70.1,80.43 70.1,80.26 69.85,80.01 JP2.7
N$6
  Top 0.203: R6522.3 74.02,84.18 71.31,84.18 70.1,82.97 70.1,82.13 69,81.03 68.16,81.03 67.14,80.01 JP2.5
N$7
  Top 0.203: R6522.2 71.83,84.53 71.16,84.53 69.6,82.97 69.6,82.13 68.85,81.38 65.97,81.38 64.6,80.01 JP2.3
N$8
  Bottom 0.203: U1.36 WDC.2
N$9
  Top 0.203: BANK.2 U$1.1
N$10
  Top 0.203: IC2.12 IC2.3
N$11
  Bottom 0.203: R6522.6 74.93,78.74 JP2.10
N$12
  Bottom 0.203: JP2.8 70.1,81.03 70.1,79.59 73.49,76.2 R6522.7
N$13
  Bottom 0.203: JP2.6 67.56,81.03 67.56,79.59 73.49,73.66 R6522.8
N$14
  Bottom 0.203: JP2.4 65.02,81.03 65.02,79.59 73.49,71.12 R6522.9
N$15
  Top 0.203: JP3.3 65.02,61.21 65.02,62.65 70.95,68.58 R6522.10
N$16
  Top 0.203: JP3.5 67.56,61.21 67.56,62.65 70.95,66.04 R6522.11
N$17
  Top 0.203: JP3.7 70.1,61.21 70.1,62.65 70.95,63.5 R6522.12
N$18
  Top 0.203: JP3.9 72.39,60.96 R6522.13
N$19
  Bottom 0.203: JP3.10 74.93,58.42 R6522.14
N$20
  Bottom 0.203: JP3.8 69.85,62.23 70.1,61.98 70.1,61.81 70.7,61.21 71.03,61.21 72.14,60.11 72.14,59.94 R6522.15
N$21
  Bottom 0.203: JP3.6 67.31,62.23 67.56,61.98 67.56,61.81 68.16,61.21 68.49,61.21 69.6,60.11 69.6,59.78 70.7,58.67 70.87,58.67 R6522.16
N$22
  Bottom 0.203: JP3.4 64.77,62.23 65.02,61.98 65.02,61.81 65.62,61.21 65.95,61.21 67.06,60.11 67.06,59.78 68.16,58.67 68.33,58.67 R6522.17
N$24
  Top 0.203: R6522.39 84.18,81.64 84.18,76.05 80.51,72.39 JP4.2
N$25
  Top 0.203: JP4.3 62.23,68.58 70.45,68.58 71.5,69.63 77.44,69.63 78.49,68.58 78.74,68.58 78.74,50.8 R6522.18
N$26
  Top 0.203: R6522.19 63.25,58.67 63.08,58.67 62.23,59.52 62.23,66.04 JP4.4
N$31
  Top 0.203: WREN.2 59.69,4.4 58.12,5.97 58.12,6.73 59.69,8.3 U$1.27
N$33
  Bottom 0.813: Q1.P$2 20.32,55.78 20.32,48.26 17.78,45.72 U1.3
N$35
  Bottom 0.813: U3.12 SERIAL.1
N$36
  Bottom 0.813: SERIAL.2 29.21,92.71 31.75,90.17 U3.10
N$38
  Bottom 0.813: Q2.1 38.23,92.58 39.37,91.44 U3.7
N$39
  Bottom 0.813: U3.6 41.91,91.44 43.18,92.71 43.05,92.84 Q2.2 44.32,92.71 C8.1
PHI0
  Bottom 0.813: U1.37 27.94,43.18 25.3,45.82 Q1.P$1 C9.1
PHI2  (via drill 0.35)
  Top 0.152: v94.34,48.84 v94.34,46.94
  Top 0.203: U1.39 v41.91,48.26
  Bottom 0.152: v94.34,46.94 94.34,45.72 95.33,44.73 97.16,44.73 98.6,43.28 98.6,20.19 96.55,18.14 96.55,17.83 JP1.24 | v94.34,48.84 93.88,48.84 92.96,49.76 90.14,49.76 87.78,52.12 87.73,52.17
  Bottom 0.203: v41.91,48.26 50.8,48.26 IC2.13 | IC2.13 55.88,48.26 58.42,48.26 IC2.10 61.55,50.8 63.12,52.38 72.33,52.38 74.96,49.75 85.31,49.75 87.73,52.17 88.9,53.34 R6522.25 | U3.27 53.34,72.39 IC2.13
R/W  (via drill 0.35)
  Top 0.203: v41.91,44.45 39.37,44.45 36.58,41.66 34.38,41.66 33.78,41.06 33.78,38.86 U1.34 | v63.5,53.34 IC2.9
  Bottom 0.203: R6522.22 89.95,47.21 67.68,47.21 64.09,50.8 IC2.9 63.5,49.53 60.96,46.99 57.15,46.99 IC2.2 IC2.1 49.53,44.45 v41.91,44.45 | U3.28 54.61,62.23 v63.5,53.34
RDY  (via drill 0.35)
  Top 0.152: v90.14,7.47 90.14,7.92 88.92,9.14 81.15,9.14 79.02,7.01 76.2,7.01 75.97,7.24 63.09,7.24 v60.35,4.5 | v41.53,4.5 34.75,4.5 31.39,1.14 13.41,1.14 11.05,3.5 11.05,47.4 10.21,48.23 R7.2
  Bottom 0.152: v90.14,7.47 95.33,12.65 96.47,12.65 JP1.26 | v41.53,4.5 v60.35,4.5
  Bottom 0.203: R7.2 U1.2

### Text on the board
tNames: R-T-G | OMEN Bravo issue 3 | G-7-6-5-4 / +-0-1-2-3 | SYSTEM | PORT A | CA1 / CA2 / CB1 / CB2 | PORT B | +5 * GND